# EAGLE design Timer (EAGLE 7.1.0)
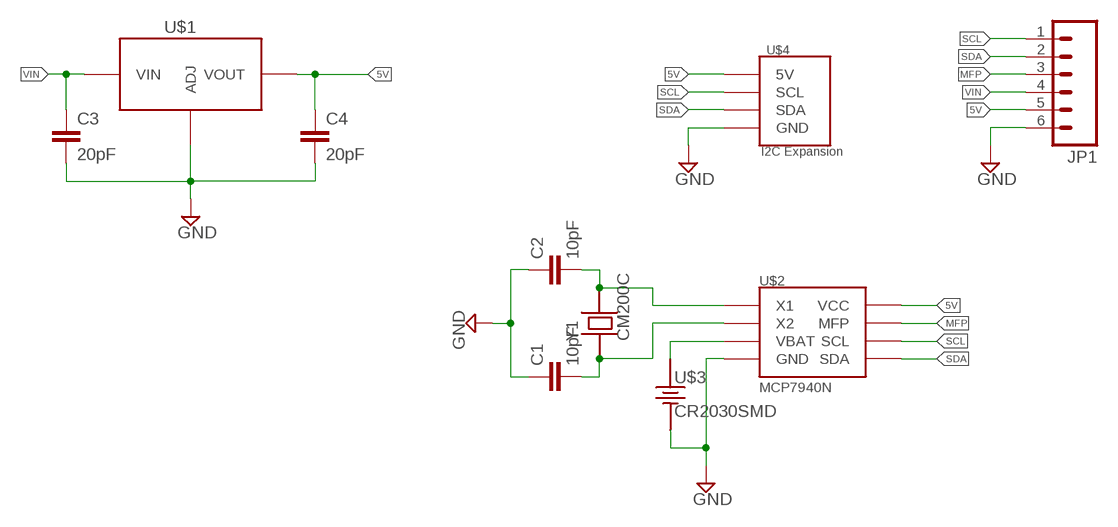
[diagram p0: schematic, sheet 1]

## Parts
C1  10pF  CAP0603-CAP  [0603-CAP]
C2  10pF  CAP0603-CAP  [0603-CAP]
C3  20pF  CAP0603-CAP  [0603-CAP]
C4  20pF  CAP0603-CAP  [0603-CAP]
JP1  M06SILK_FEMALE_PTH  [1X06]
U$1  LM1117  [SOT223]
U$2  MCP7940NSOIC-8  [SOIC-8]
U$3  CR2030SMD  [CR2030SMD]
U$4  I2CEXPANSION  [JST-4-PTH-VERT]
Y1  CM200C  [CM2##]

## Nets
5V: C4.1 JP1.5 U$1.P2(VOUT) U$1.P4(VOUT) U$2.VCC U$4.1(5V)
GND: C1.1 C2.1 C3.2 C4.2 JP1.6 U$1.P1(ADJ) U$2.GND U$3.GND1(NEG) U$3.GND(NEG) U$4.4(GND)
MFP: JP1.3 U$2.MFP
N$1: U$2.VBAT U$3.POS
N$2: C2.2 U$2.X1 Y1.4
N$3: C1.2 U$2.X2 Y1.1
SCL: JP1.1 U$2.SCL U$4.2(SCL)
SDA: JP1.2 U$2.SDA U$4.3(SDA)
VIN: C3.1 JP1.4 U$1.P3(VIN)

## Library data of the parts
C1-C4 = SparkFun-Capacitors:CAP: Capacitor Standard 0603 ceramic capacitor, and 0.1" leaded capacitor.
JP1 = SparkFun-Connectors:M06: Header 6 Standard 6-pin 0.1" header. Use with straight break away headers (SKU : PRT-00116), right angle break away headers (PRT-00553), swiss pins (PRT-00743), machine pins (PRT-00117), and female headers (PRT-00115). Molex polarized connector foot print use with SKU : PRT-08094 with associated crimp pins and housings. NOTES ON THE VARIANTS LOCK and LOCK_LONGPADS... This footprint was designed to help hold the alignment of a through-hole component (i.e. 6-pin header) while soldering it into place. You may notice that each hole has been shifted either up or down by 0.005 of an inch from it's more standard position (which is a perfectly straight line). This slight alteration caused the pins (the squares in the middle) to touch the edges of the holes. Because they are alternating, it causes a "brace" to hold the component in place. 0.005 has proven to be the perfect amount of "off-center" position when using our standard breakaway headers. Although looks a little odd when you look at the bare footprint, once you have a header in there, the alteration is very hard to notice. Also,if you push a header all the way into place, it is covered up entirely on the bottom side. This idea of altering the position of holes to aid alignment will be further integrated into the Sparkfun Library for other footprints. It can help hold any component with 3 or more connection pins.; PROD_ID: CONN-08437
U$1 = Jordan ICs:LM1117: LM1117 5vEd A linear voltage regulator set to 5volts. Max output is 800ma
U$2 = Jordan ICs:MCP7940N: MC7940N This is a real time clock ic
U$3 = Jordan Connectors:CR2030
U$4 = Jordan Connectors:I2CEXPANSION
Y1 = Jordan Passive:CM200C

## Board
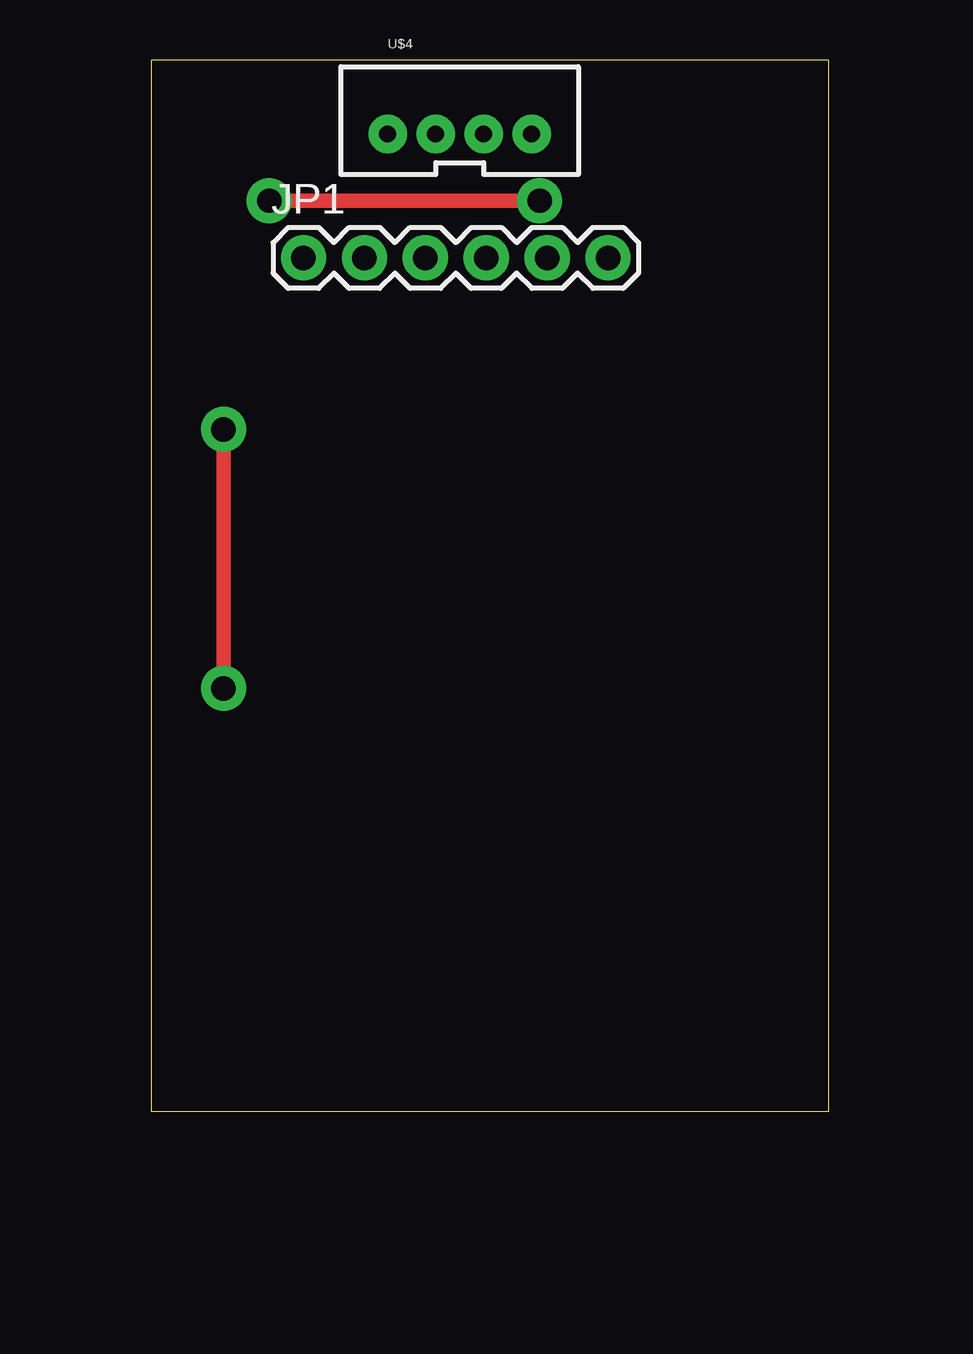
[diagram p1: board, top side]
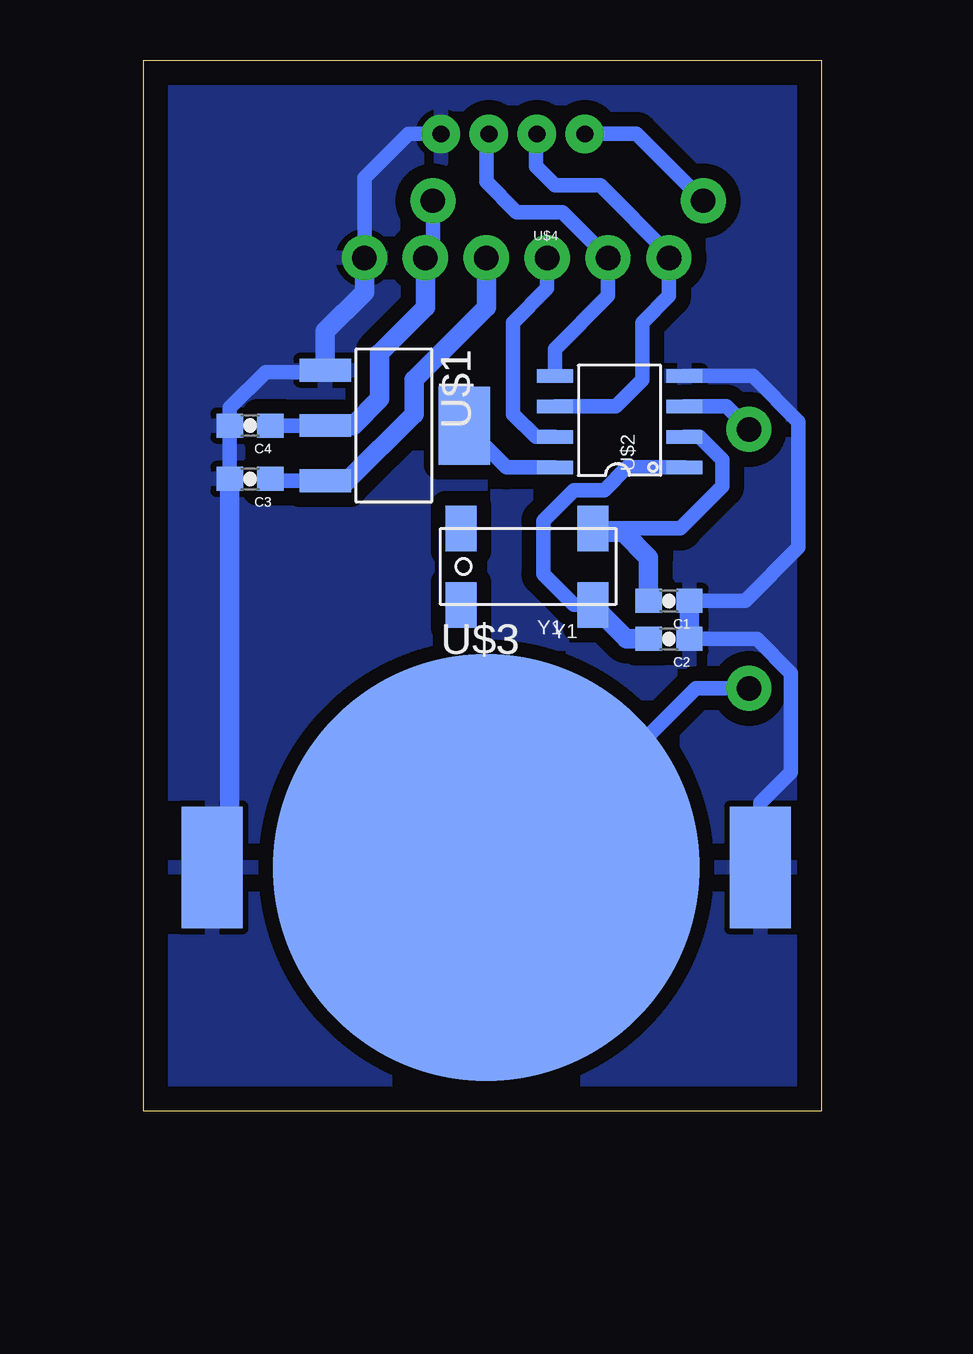
[diagram p2: board, bottom side, seen from below]

Size 28.25 x 43.8 mm. Coordinates in mm from the lower left corner, seen from the top.
Outline: 0,0 28.25,0 28.25,43.8 0,43.8 0,0
Copper layers (1*16): Top 0.035mm / dielectric 1.5mm / Bottom 0.035mm
Design rules "default": minimum track width 10mil, minimum drill 24mil, track to track 8mil, track to pad 8mil, pad to pad 8mil, via to via 8mil, smd to smd 8mil, copper to edge 40mil, drill to drill 8mil, minimum pad ring 10mil, minimum via ring 8mil, stop-mask expansion 4mil, vias tented up to drill 0mil, thermal gap 10mil

### Footprints (pad centres in the part's own frame; a part is rotated, then mirrored left to right if it is on the bottom)
0603-CAP = smd 1.1 x 1: 1 -0.85,0; 2 0.85,0
1X06 = drill 1.016 pad 1.88: 1 0,0; 2 2.54,0; 3 5.08,0; 4 7.62,0; 5 10.16,0; 6 12.7,0
SOT223 = smd 0.95 x 2.15: P1 -2.3,-2.9; P2 0,-2.9; P3 2.3,-2.9 | smd 3.25 x 2.15: P4 0,2.9
SOIC-8 = smd 0.55 x 1.5: GND 1.746,-2.699; MFP -0.794,2.701; SCL 0.476,2.701; SDA 1.746,2.701; VBAT 0.476,-2.699; VCC -2.064,2.701; X1 -2.064,-2.699; X2 -0.794,-2.699
CR2030SMD = smd 2.54 x 5.08: GND 11.43,0; GND1 -11.43,0 | smd 17.78 x 17.78: POS 0,0
JST-4-PTH-VERT = drill 0.7 pad 1.6: 1 -3,-0.55; 2 -1,-0.55; 3 1,-0.55; 4 3,-0.55
CM2## = smd 1.3 x 1.9: 1 0,0; 2 5.5,0; 3 5.5,3.2; 4 0,3.2

### Placement (x,y rotation side)
C1  6.35,21.27 180 bottom
C2  6.35,19.68 180 bottom
C3  23.81,26.35 180 bottom
C4  23.81,28.57 180 bottom
JP1  6.35,35.56 0 top
U$1  17.78,28.57 270 bottom
U$2  8.41,28.89 90 bottom
U$3  13.97,10.16 0 bottom
U$4  12.86,41.27 0 top
Y1  9.53,24.29 180 bottom

### Tracks (layer width: path | path; a pad name or v marks a point on that pad's centre or on a via)
5V  (via drill 1.02 pad 1.88)
  Top 0.61: v4.92,37.94 v16.19,37.94
  Bottom 0.61: U$1.P2 C4.1 | U$2.VCC 13.13,26.83 U$1.P4 | U$4.1 7.71,40.73 v4.92,37.94 | v16.19,37.94 16.19,35.88 JP1.5
  Bottom 0.813: JP1.5 16.51,33.5 18.41,31.59 18.41,29.69 19.53,28.57 U$1.P2
GND
  Bottom 0.406: 20.76,30.8 U$1.P1
  Bottom 0.61: C3.2 C4.2 24.66,29.31 23.18,30.8 20.76,30.8 | C2.1 2.7,19.68 1.27,18.26 1.27,14.13 2.54,12.86 U$3.GND | C1.1 3.17,21.27 0.95,23.5 0.95,28.73 2.86,30.64 U$2.GND | U$4.4 17.22,40.73 19.05,38.89 JP1.6
  Bottom 0.813: C2.1 C1.1 | U$1.P1 20.68,32.5 19.05,34.13 JP1.6 | C3.2 24.66,10.9 U$3.GND1
  pour Bottom (isolate 0.61): -3.81,-1.27 30.48,-1.27 30.48,44.45 -3.81,44.45
MFP
  Bottom 0.61: U$2.MFP 11.91,28.1 12.86,29.05 12.86,32.86 11.43,34.29 JP1.3
N$1  (via drill 1.02 pad 1.88)
  Top 0.61: v3.02,28.42 v3.02,17.62
  Bottom 0.61: U$2.VBAT 3.97,29.37 v3.02,28.42 | v3.02,17.62 5.24,17.62 12.7,10.16 U$3.POS
N$2
  Bottom 0.61: U$2.X1 8.1,26.83 9.05,25.88 10.32,25.88 11.59,24.61 11.59,22.38 10.32,21.11 9.55,21.11 Y1.4
  Bottom 0.813: C2.2 8.12,19.68 Y1.4
N$3
  Bottom 0.61: Y1.1 5.87,24.29 4.13,26.04 4.13,27.15 5.08,28.1 U$2.X2
  Bottom 0.813: C1.2 7.2,23.07 8.26,24.13 9.37,24.13 Y1.1
SCL
  Bottom 0.61: U$2.SCL 8.57,29.37 7.46,30.48 7.46,32.86 6.35,33.97 JP1.1 6.35,35.72 9.21,38.58 11.11,38.58 11.91,39.37 11.91,39.98 U$4.2
SDA
  Bottom 0.61: U$2.SDA 11.12,31.75 8.89,33.97 JP1.2 10.79,37.47 12.7,37.47 13.97,38.73 13.97,40.04 U$4.3
VIN
  Bottom 0.406: 22.89,26.27 C3.1
  Bottom 0.61: U$1.P3 22.89,26.27
  Bottom 0.813: U$1.P3 19.76,26.27 16.99,29.05 16.99,30.48 13.97,33.5 JP1.4

### Text on the board
tNames: JP1
bNames: U$4 | U$1 | C4 | U$2 | C3 | C1 | Y1 | C2 | U$3